# EAGLE design Teedi REV A1 (EAGLE 7.3.0)
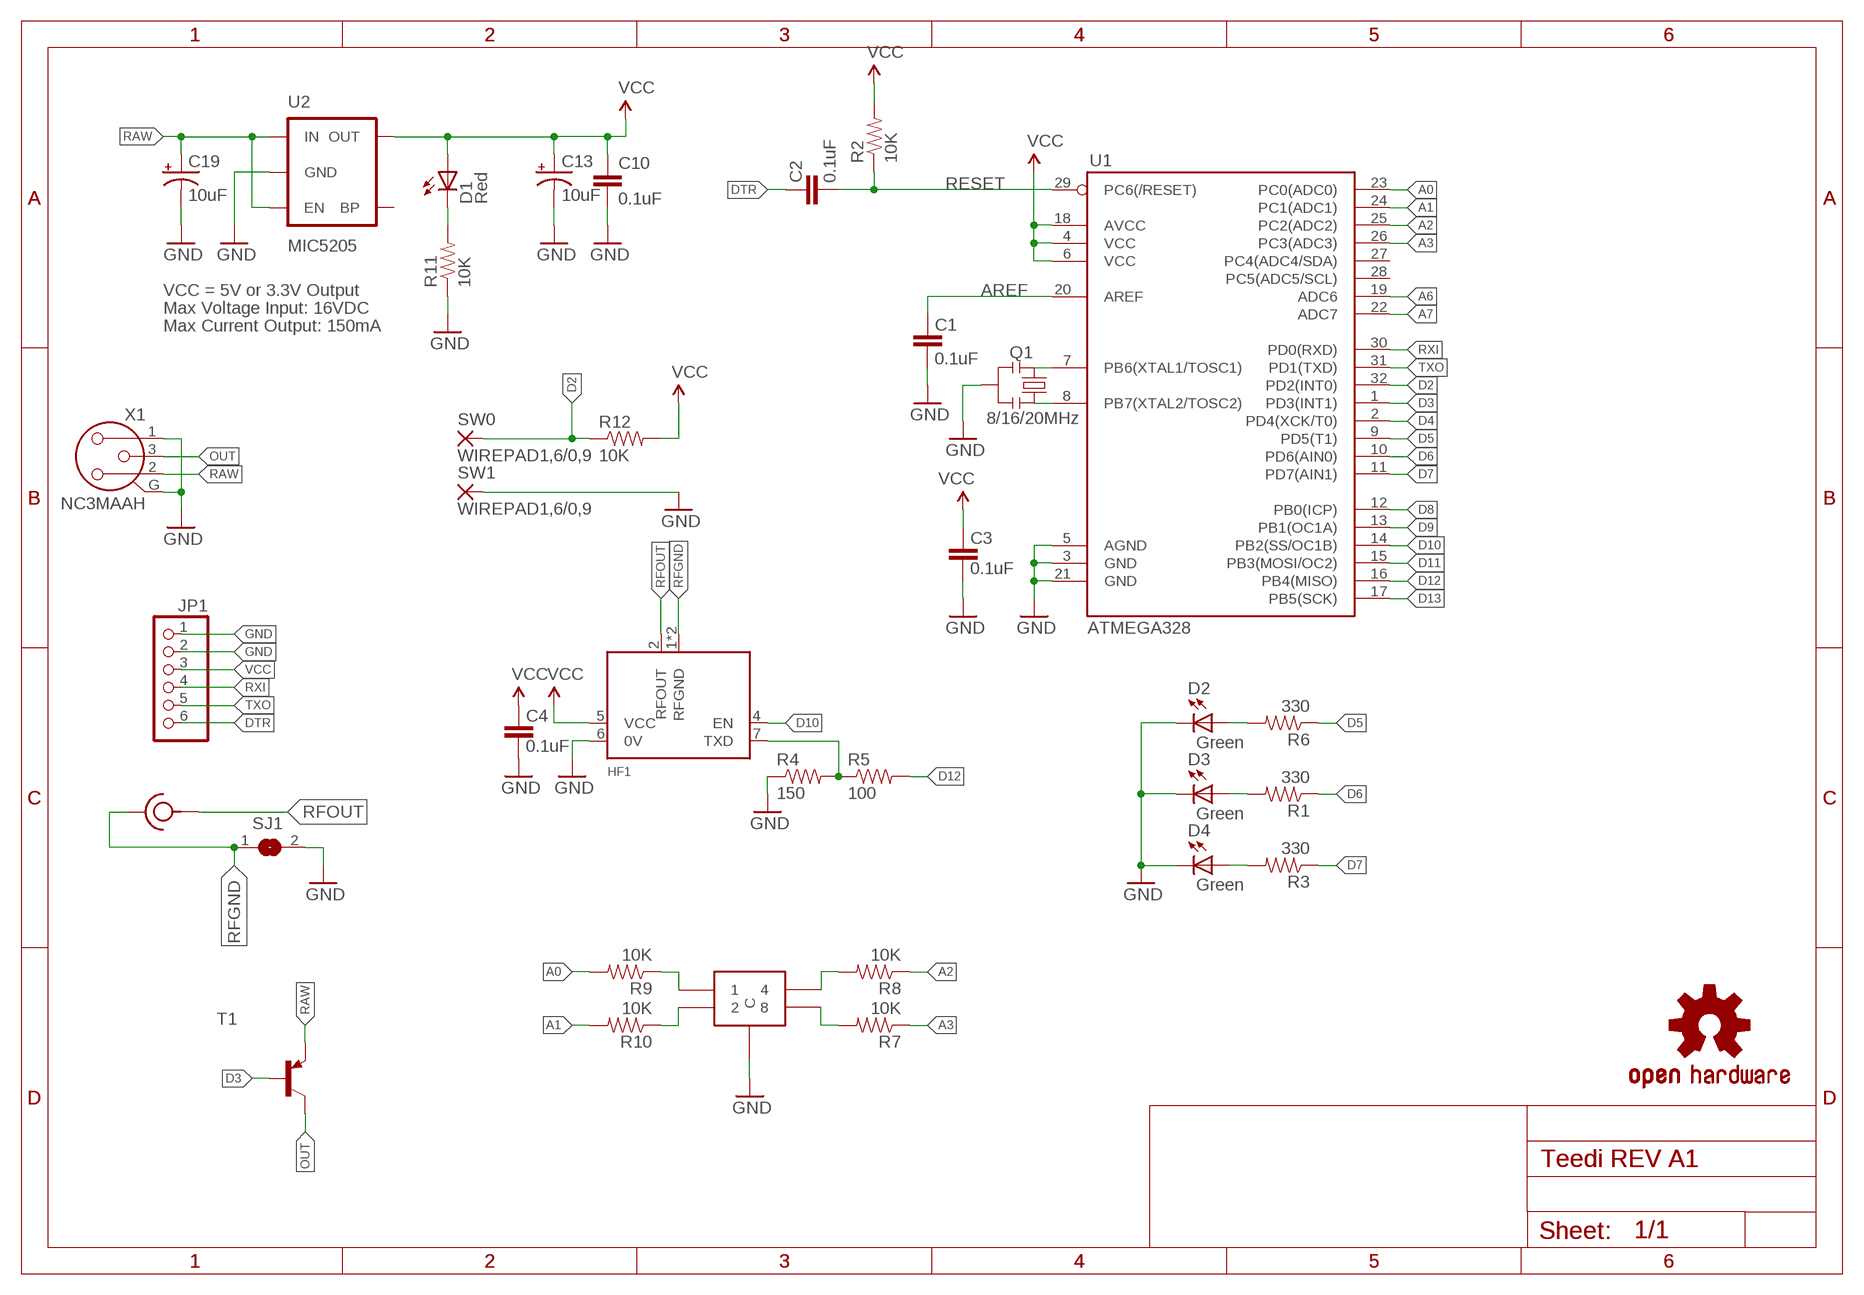
[diagram p0: schematic, sheet 1]

## Parts
C1  0.1uF  CAP0603-CAP  [0603-CAP]
C2  0.1uF  CAP0603-CAP  [0603-CAP]
C3  0.1uF  CAP0603-CAP  [0603-CAP]
C4  0.1uF  CAP0603-CAP  [0603-CAP]
C10  0.1uF  CAP0603-CAP  [0603-CAP]
C13  10uF  CAP_POL1206  [EIA3216]
C19  10uF  CAP_POL1206  [EIA3216]
D1  Red  LED  [0603-LED-ALT1]
D2  Green  LED  [0603-LED-ALT1]
D3  Green  LED  [0603-LED-ALT1]
D4  Green  LED  [0603-LED-ALT1]
HF1  TX2A-433-64  [TX2A]
JP1  PINHD-1X6  [1X06]
Q1  8/16/20MHz  RESONATOR1:1  [RESONATOR-SMD-1:1]
R1  330  RESISTOR0603-RES  [0603-RES]
R2  10K  RESISTOR0603-RES  [0603-RES]
R3  330  RESISTOR0603-RES  [0603-RES]
R4  150  RESISTOR0603-RES  [0603-RES]
R5  100  RESISTOR0603-RES  [0603-RES]
R6  330  RESISTOR0603-RES  [0603-RES]
R7  10K  RESISTOR0603-RES  [0603-RES]
R8  10K  RESISTOR0603-RES  [0603-RES]
R9  10K  RESISTOR0603-RES  [0603-RES]
R10  10K  RESISTOR0603-RES  [0603-RES]
R11  10K  RESISTOR0603-RES  [0603-RES]
R12  10K  RESISTOR0603-RES  [0603-RES]
RF1  132203  [132203]
SJ1  SJ  [SJ]
SW0  WIREPAD1,6/0,9  [1,6/0,9]
SW1  WIREPAD1,6/0,9  [1,6/0,9]
T1  -PNP-SOT23-BCE  [SOT23-BCE]
U1  ATMEGA328  ATMEGA168  [TQFP32-08]
U2  MIC5205  V_REG_LDOSMD  [SOT23-5]
U$3  OSHW-LOGOS  [OSHW-LOGO-S]
U$5  PT65-101-L508  [PT65-101-L508]
X1  NC3MAAH  [NC3MAH]

## Nets
A0: R9.2 U1.23(PC0(ADC0))
A1: R10.2 U1.24(PC1(ADC1))
A2: R8.1 U1.25(PC2(ADC2))
A3: R7.1 U1.26(PC3(ADC3))
A6: U1.19(ADC6)
A7: U1.22(ADC7)
AREF: C1.2 U1.20(AREF)
D2: R12.1 SW0.1(P) U1.32(PD2(INT0))
D3: T1.B U1.1(PD3(INT1))
D4: U1.2(PD4(XCK/T0))
D5: R6.1 U1.9(PD5(T1))
D6: R1.1 U1.10(PD6(AIN0))
D7: R3.1 U1.11(PD7(AIN1))
D8: U1.12(PB0(ICP))
D9: U1.13(PB1(OC1A))
D10: HF1.4(EN) U1.14(PB2(SS/OC1B))
D11: U1.15(PB3(MOSI/OC2))
D12: R5.2 U1.16(PB4(MISO))
D13: U1.17(PB5(SCK))
DTR: C2.2 JP1.6
GND [vcc]: C1.1 C3.1 C4.1 C10.2 C13.C(-) C19.C(-) D2.C D3.C D4.C HF1.6(0V) JP1.1 JP1.2 Q1.2 R4.1 R11.1 SJ1.2 SW1.1(P) U1.3(GND) U1.5(AGND) U1.21(GND) U2.2(GND) U$5.C1(C) U$5.C2(C) X1.1 X1.G
N$1: Q1.3 U1.8(PB7(XTAL2/TOSC2))
N$2: Q1.1 U1.7(PB6(XTAL1/TOSC1))
N$3: D3.A R1.2
N$4: D1.C R11.2
N$5: D4.A R3.2
N$6: HF1.7(TXD) R4.2 R5.1
N$7: D2.A R6.2
N$8: R9.1 U$5.1
N$9: R10.1 U$5.2
N$10: R8.2 U$5.4
N$11: R7.2 U$5.8
OUT: T1.C X1.3
RAW [vcc]: C19.A(+) T1.E U2.1(IN) U2.3(EN) X1.2
RESET: C2.1 R2.1 U1.29(PC6(/RESET))
RFGND: HF1.1(RFGND) HF1.3(RFGND) RF1.G1(GND) RF1.G2(GND) RF1.G3(GND) RF1.G4(GND) SJ1.1
RFOUT: HF1.2(RFOUT) RF1.P(RF)
RXI: JP1.4 U1.30(PD0(RXD))
TXO: JP1.5 U1.31(PD1(TXD))
VCC: C3.2 C4.2 C10.1 C13.A(+) D1.A HF1.5(VCC) JP1.3 R2.2 R12.2 U1.4(VCC) U1.6(VCC) U1.18(AVCC) U2.5(OUT)
Unconnected: U1.27(PC4(ADC4/SDA)) U1.28(PC5(ADC5/SCL)) U2.4(BP)

## Notes on the sheet
- VCC = 5V or 3.3V Output
- Max Voltage Input: 16VDC
- Max Current Output: 150mA

## Library data of the parts
C1-C4 C10 = SparkFun:CAP: Capacitor Standard 0603 ceramic capacitor, and 0.1" leaded capacitor.; MF: MULTICOMP; MPN: MC0603F104Z160CT; OC_FARNELL: 1759017
C13 C19 = SparkFun:CAP_POL: Capacitor Polarized These are standard SMD and PTH capacitors. Normally 10uF, 47uF, and 100uF in electrolytic and tantalum varieties. Always verify the external diameter of the through hole cap, it varies with capacity, voltage, and manufacturer. The EIA devices should be standard.; MF: MULTICOMP; MPN: MCCTA106M006; OC_FARNELL: 1190107
D1 = Testing:LED: LEDs Standard schematic elements and footprints for 5mm, 3mm, 1206, and 0603 sized LEDs. 5mm - Spark Fun Electronics SKU : COM-00529 (and others); MF: MULTICOMP; MPN: MCL-S290SRC; OC_FARNELL: 1581244
D2-D4 = Testing:LED: LEDs Standard schematic elements and footprints for 5mm, 3mm, 1206, and 0603 sized LEDs. 5mm - Spark Fun Electronics SKU : COM-00529 (and others); MF: MULTICOMP; MPN: 703-0109; OC_FARNELL: 2112121
HF1 = radiometrix:TX2A; MF: RADIOMETRIX; MPN: TX2A-433-64; OC_FARNELL: 1348821
JP1 = pinhead:PINHD-1X6: PIN HEADER; MF: MULTICOMP; MPN: MC34751; OC_FARNELL: 1593430
Q1 = Testing:RESONATOR: Resonator Small SMD resonator. This is the itty bitty 10/20MHz resonators with built in caps. CSTCE10M0G55 and CSTCE20M0V53. Footprint for SMD has been used in SFE production for years, and does work okay. 1:1 is an attempt to get larger fillets on the sides so it will be easier to inspect these solders in our AOI machine. The pads have been minimized to match the actual metal under the resonator. To see this relation, it includes an image import of the bottom side of the component. Imported to scale on layer 200.; MF: MURATA; MPN: CSTCE8M00G55Z-R0; OC_FARNELL: 1615352
R1 R3 R6 = SparkFun:RESISTOR: Resistor Basic schematic elements and footprints for 0603, 1206, and PTH resistors.; MF: MULTICOMP; MPN: MCWR06X3300FTL; OC_FARNELL: 2447339
R2 R7-R12 = SparkFun:RESISTOR: Resistor Basic schematic elements and footprints for 0603, 1206, and PTH resistors.; MF: MULTICOMP; MPN: MCHP03W8F1002T5E; OC_FARNELL: 1576297
R4 = SparkFun:RESISTOR: Resistor Basic schematic elements and footprints for 0603, 1206, and PTH resistors.; MF: MULTICOMP; MPN: MCWR06X1500FTL; OC_FARNELL: 2446572
R5 = SparkFun:RESISTOR: Resistor Basic schematic elements and footprints for 0603, 1206, and PTH resistors.; MF: MULTICOMP; MPN: MCWR06X1000FTL; OC_FARNELL: 2447227
RF1 = amphenol:132203; MF: AMPHENOL CONNEX; MPN: 132203; OC_FARNELL: 2144524
SJ1 = jumper:SJ: SMD solder JUMPER; OC_FARNELL: unknown
SW0 SW1 = wirepad:WIREPAD: Wire PAD connect wire on PCB; OC_FARNELL: unknown
T1 = transistor:*-PNP-: PNP Transistror; MF: NXP; MPN: BC807-25; OC_FARNELL: 1081221
U1 = SparkFun:ATMEGA168; MF: ATMEL; MPN: ATMEGA328-AUR; OC_FARNELL: 2443176
U2 = SparkFun:V_REG_LDO: Voltage Regulator LDO Standard 150mA LDO voltage regulator in SOT-23 layout. Micrel part MIC5205. BP (by-pass) pin is used to lower output noise with 470pF cap.; MF: MICREL SEMICONDUCTOR; MPN: MIC5205-3.0YM5 TR; OC_FARNELL: 2100318
U$3 = SparkFun:OSHW-LOGO: Open Source Hardware Logo This logo indicates the piece of hardware it is found on incorporates a OSHW license and/or adheres to the definition of open source hardware found here: http://freedomdefined.org/OSHW; OC_FARNELL: unknown
U$5 = apem:PT65-101-?; MF: APEM; MPN: PT65-101-L508; OC_FARNELL: 1082477
X1 = con-neutrik_ag:NC3: Neutrik Audio Connector XLR SERIES Stereo 1/4" jack Source: www.neutrik.com/; MF: NEUTRIK; MPN: NC3MAAH; OC_FARNELL: 1310044

## Net classes
0 default: width 0.203 mm
1 vcc: width 0.254 mm

## Board
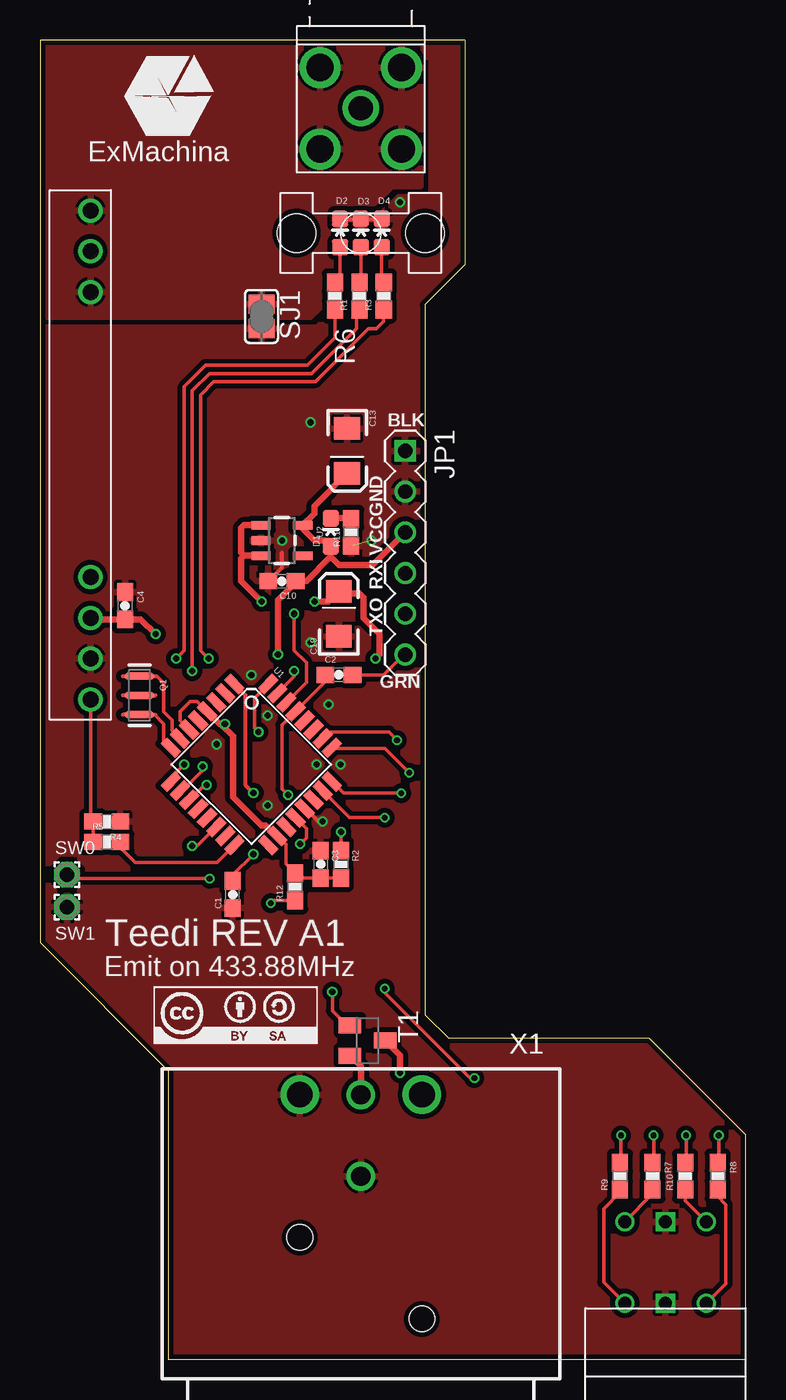
[diagram p1: board, top side]
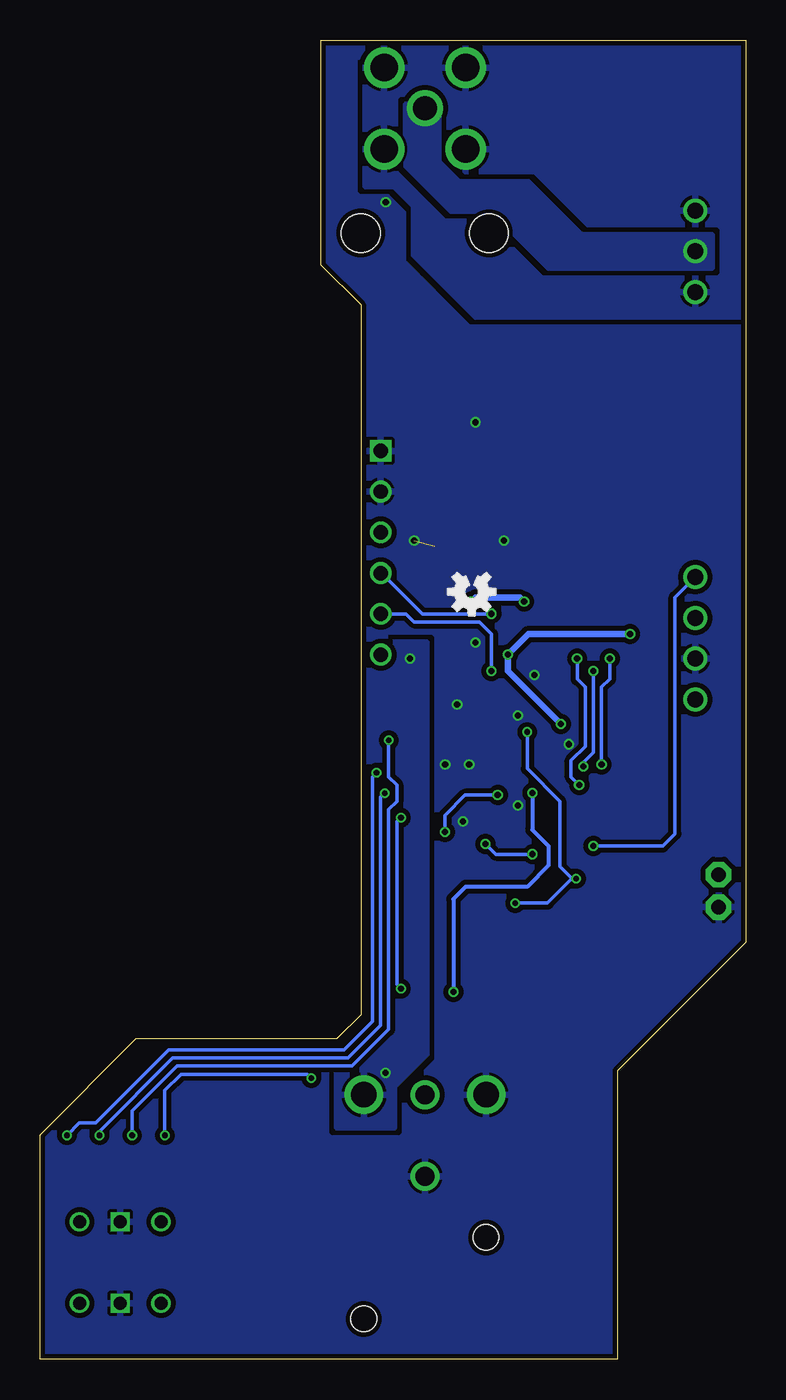
[diagram p2: board, bottom side, seen from below]

Size 44 x 82.25 mm. Coordinates in mm from the lower left corner, seen from the top.
Outline: 26.5,82.25 0,82.25 0,26 8,18 8,0 44,0 44,14 38,20 25.49,20 24,21.49 24,65.75 26.5,68.25 26.5,82.25
Copper layers (1*16): Top 0.018mm / dielectric 1.55mm / Bottom 0.018mm
Design rules "eC_2Layer_PClass6_BaseCopperO18_eCDefault": minimum track width 0.15mm, minimum drill 0.35mm, track to track 0.15mm, track to pad 0.15mm, pad to pad 0.15mm, via to via 0.15mm, smd to smd 0mil, copper to edge 0.25mm, drill to drill 0.35mm, minimum pad ring 0.175mm, minimum via ring 0.125mm, stop-mask expansion 0mil, vias tented up to drill 0.45mm, thermal gap 0.2mm

### Footprints (pad centres in the part's own frame; a part is rotated, then mirrored left to right if it is on the bottom)
0603-CAP = smd 1.1 x 1: 1 -0.85,0; 2 0.85,0
EIA3216 = smd 1.4 x 1.6: A 1.4,0; C -1.4,0
0603-LED-ALT1 = smd 1 x 1: A 0,-0.877; C 0,0.877
TX2A = drill 1: 1 -15.24,0; 2 -12.7,0; 3 -10.16,0; 4 7.62,0; 5 10.16,0; 6 12.7,0; 7 15.24,0
1X06 = drill 0.9 square: 1 -6.35,0 | drill 0.9: 2 -3.81,0; 3 -1.27,0; 4 1.27,0; 5 3.81,0; 6 6.35,0
RESONATOR-SMD-1:1 = smd 0.45 x 1.905: 1 -1.2,0; 2 0,0; 3 1.2,0
0603-RES = smd 1.1 x 1: 1 -0.85,0; 2 0.85,0
132203 = drill 1.7: G1 -2.54,2.54; G2 2.54,2.54; G3 2.54,-2.54; G4 -2.54,-2.54 | drill 1.5: P 0,0
SJ = smd 1.168 x 1.6: 1 -0.762,0; 2 0.762,0
1,6/0,9 = drill 0.914 pad 1.6 octagon: 1 0,0
SOT23-BCE = smd 1 x 1.4: B -0.95,-1.1; C 0.95,-1.1; E 0,1.1
TQFP32-08 = smd 1.27 x 0.559: 1 -4.293,2.8; 2 -4.293,2; 3 -4.293,1.2; 4 -4.293,0.4; 5 -4.293,-0.4; 6 -4.293,-1.2; 7 -4.293,-2; 8 -4.293,-2.8; 17 4.293,-2.8; 18 4.293,-2; 19 4.293,-1.2; 20 4.293,-0.4; 21 4.293,0.4; 22 4.293,1.2; 23 4.293,2; 24 4.293,2.8 | smd 0.559 x 1.27: 9 -2.8,-4.293; 10 -2,-4.293; 11 -1.2,-4.293; 12 -0.4,-4.293; 13 0.4,-4.293; 14 1.2,-4.293; 15 2,-4.293; 16 2.8,-4.293; 25 2.8,4.293; 26 2,4.293; 27 1.2,4.293; 28 0.4,4.293; 29 -0.4,4.293; 30 -1.2,4.293; 31 -2,4.293; 32 -2.8,4.293
SOT23-5 = smd 0.55 x 1.2: 1 -0.95,-1.3; 2 0,-1.3; 3 0.95,-1.3; 4 0.95,1.3; 5 -0.95,1.3
PT65-101-L508 = drill 0.8: 1 2.54,0; 2 -2.54,-5.08; 4 -2.54,0; 8 2.54,-5.08 | drill 0.8 square: C1 0,0; C2 0,-5.08
1275.100 = hole 2.4: 4,0; -4,0
NC3MAH = drill 1.6: 1 3.81,0; 2 -3.81,0 | drill 1.2: 3 0,0; G 0,5.08 | hole 1.6: -3.81,13.97; 3.81,8.89

### Placement (x,y rotation side)
C1  12.01,28.98 90 top
C2  18.64,42.67 0 top
C3  17.49,30.86 270 top
C4  5.3,46.99 270 top
C10  15.08,48.51 180 top
C13  19.14,56.64 270 top
C19  18.64,46.48 90 top
D1  18.13,51.56 0 top
D2  18.7,70.22 0 top
D3  20,70.22 0 top
D4  21.3,70.22 0 top
HF1  3.14,56.39 270 top
JP1  22.77,50.29 270 top
Q1  6.19,41.4 270 top
R1  19.91,66.29 90 top
R2  18.76,30.86 270 top
R3  21.43,66.29 90 top
R4  4.16,33.53 180 top
R5  4.16,32.26 0 top
R6  18.38,66.29 90 top
R7  38.19,11.43 270 top
R8  42.26,11.43 270 top
R9  36.16,11.43 90 top
R10  40.23,11.43 90 top
R11  19.4,51.56 90 top
R12  15.91,29.46 90 top
RF1  20,78 0 top
SJ1  13.81,65.02 270 top
SW0  1.68,30.23 270 top
SW1  1.68,28.19 270 top
T1  20.42,19.88 270 top
U1  13.18,37.08 315 top
U2  15.08,51.05 270 top
U$3  17.09,47.85 180 bottom
U$4  [CC-BY-SA]  12.35,21.91 0 top
U$5  39,3.5 180 top
U$7  [EXM-LOGO]  7.97,78.74 0 top
U$8  [1275.100]  20,70.22 0 top
X1  20,16.5 180 top

### Tracks (layer width: path | path; a pad name or v marks a point on that pad's centre or on a via)
A0  (via drill 0.35)
  Top 0.203: U1.23 19.3,33.78 v21.5,33.78 | v21.5,23.11 21.5,22.86 26.83,17.53 v27.08,17.53 | v36.23,13.97 36.23,12.35 R9.2
  Bottom 0.203: v21.5,33.78 21.75,33.53 21.75,23.37 v21.5,23.11 | v27.08,17.53 27.34,17.78 35.21,17.78 36.23,16.76 v36.23,13.97
A1  (via drill 0.35)
  Top 0.203: U1.24 18.91,35.31 v22.51,35.31 | R10.2 40.29,12.35 v40.29,13.97
  Bottom 0.203: v22.51,35.31 22.77,35.05 22.77,20.83 24.8,18.8 35.72,18.8 40.29,14.22 v40.29,13.97
A2  (via drill 0.35)
  Top 0.203: R8.1 42.32,12.35 v42.32,13.97 | v23.02,36.58 21.5,38.1 18.23,38.1 U1.25
  Bottom 0.203: v23.02,36.58 23.27,36.32 23.27,21.08 25.05,19.3 35.97,19.3 40.55,14.73 41.56,14.73 v42.32,13.97
A3  (via drill 0.35)
  Top 0.203: U1.26 17.72,38.7 18.13,39.12 21.75,39.12 v22.26,38.61 | R7.1 38.26,12.35 v38.26,13.97
  Bottom 0.203: v22.26,38.61 22.26,36.32 21.75,35.81 21.75,34.8 22.26,34.29 22.26,20.57 24.54,18.29 35.47,18.29 38.26,15.49 v38.26,13.97
AREF  (via drill 0.38)
  Top 0.203: U1.20 16.6,33.09 16.6,32.51 v16.22,32.13 | v13.3,31.5 12.01,30.2 C1.2
  Bottom 0.203: v16.22,32.13 15.59,31.5 v13.3,31.5
D2  (via drill 0.35)
  Top 0.203: U1.32 13.37,41.24 13.37,39.37 v13.62,39.12 | v10.57,29.97 1.94,29.97 SW0.1 | R12.1 14.55,28.61 v14.38,28.45
  Bottom 0.203: v13.62,39.12 13.62,36.83 11.59,34.8 11.59,30.73 10.83,29.97 | v14.38,28.45 12.35,28.45 10.83,29.97 | 10.83,29.97 v10.57,29.97
D3  (via drill 0.38)
  Top 0.203: v18.22,22.92 18.22,21.73 19.12,20.83 T1.B
  Top 0.254: U1.1 12.79,41.42 12.79,35.81 v13.3,35.31
  Bottom 0.254: v13.3,35.31 13.3,33.02 12.29,32 12.29,30.8 13.62,29.46 17.46,29.46 18.22,28.7 v18.22,22.92
D5  (via drill 0.38)
  Top 0.203: U1.9 8.16,36.26 v8.98,37.08 | v8.48,43.69 8.98,44.2 8.98,60.64 10.32,61.98 16.67,61.98 18.38,63.69 R6.1
  Bottom 0.203: v8.98,37.08 8.98,41.91 8.48,42.42 v8.48,43.69
D6  (via drill 0.38)
  Top 0.203: U1.10 8.89,35.46 10.13,36.7 v10.13,36.96 | v9.49,42.93 9.49,60.39 10.57,61.47 16.92,61.47 19.72,64.26 19.72,65.26 R1.1
  Bottom 0.203: v10.13,36.96 10.13,37.21 9.49,37.85 v9.49,42.93
D7  (via drill 0.38)
  Top 0.203: U1.11 9.34,34.9 10.25,35.81 v10.38,35.81 | v10.51,43.69 10,44.2 10,60.13 10.83,60.96 17.18,60.96 20.48,64.26 20.99,64.26 21.43,64.7 R3.1
  Bottom 0.203: v10.38,35.81 10.89,36.32 10.89,37.34 10,38.23 10,41.91 10.51,42.42 v10.51,43.69
D10  (via drill 0.38)
  Top 0.203: U1.14 9.79,32 v9.49,32
  Bottom 0.203: v9.49,32 5.17,32 4.41,32.77 4.41,47.5 HF1.4
D12
  Top 0.203: U1.16 11.04,30.99 5.94,30.99 5.01,31.92 R5.2
DTR
  Top 0.203: C2.2 21.43,42.67 22.7,43.94 JP1.6
GND  (via drill 0.38)  (1 unrouted)
  Top 0.254: U1.21 16.56,34.33 17.37,33.53 | D2.C D3.C D4.C | C10.2 15.08,49.36 15.08,50.29
  other vias: 15.08,51.05 13.18,42.67 17.62,33.53 20.67,51.05 16.86,44.7 14.19,40.13 17.24,37.08 14.19,34.54 16.86,58.42 11.02,38.35 22.45,72.14 18.74,37.08 17.99,40.83
  pour Top (isolate 0.305, rank 6): -10,85 50,85 50,-1 -10,-1
  pour Bottom (isolate 0.305, rank 6): -10,85 50,85 50,-1 -10,-1
N$1
  Top 0.203: 7.21,40.2 7.14,40.2 7.71,39.62 7.71,38.59 U1.8
N$2
  Top 0.203: 7.21,42.6 7.28,42.6 7.71,42.16 7.71,40.39 8.22,39.88 8.22,39.21 U1.7
N$3
  Top 0.203: D3.A 20,67.24 R1.2
N$4
  Top 0.203: R11.2 19.37,52.44 19.14,52.44
  Top 0.406: D1.C 19.14,52.44 19.24,52.44
N$5
  Top 0.203: D4.A 21.3,67.27 R3.2
N$6
  Top 0.203: R5.1 R4.2 3.14,33.69 HF1.7
N$7
  Top 0.203: D2.A 18.7,67.46 R6.2
N$8
  Top 0.203: R9.1 36.16,10.41 35.15,9.4 35.15,4.81 U$5.1
N$9
  Top 0.203: R10.1 40.23,9.89 U$5.2
N$10
  Top 0.203: R8.2 42.26,10.16 42.77,9.65 42.77,4.73 U$5.4
N$11
  Top 0.203: R7.2 38.19,10.31 U$5.8
OUT
  Top 0.406: T1.C 20,18.26 X1.3
RAW  (via drill 0.38)
  Top 0.406: U2.1 12.73,52 12.54,51.82 12.54,50.29 12.73,50.1 | 12.73,50.1 U2.3 | v17.11,47.24 18,47.24 C19.A 18.77,47.75 19.91,47.75 20.16,47.5 20.16,46.23 21.18,45.21 21.18,43.94 v20.92,43.69 | v13.81,47.24 12.54,48.51 12.54,49.92 12.73,50.1 | T1.E 22.45,18.95 v22.45,17.85
  Bottom 0.406: v17.11,47.24 16.86,47.5 14.06,47.5 v13.81,47.24
  pour Bottom (isolate 0.305): 21.94,14.48 25.49,14.48 25.49,25.47 25.56,44.7 19.91,44.7 19.91,19.05 21.94,17.02
RESET  (via drill 0.38)
  Top 0.203: v15.46,35.18 15.08,35.56 15.08,39.55 U1.29 17.79,42.26 C2.1 | v18.76,32.89 R2.1
  Bottom 0.203: v15.46,35.18 17.49,35.18 18.76,33.91 v18.76,32.89
RFGND
  pour Bottom (isolate 0.305, rank 5): -0.11,65.02 -0.11,82.3 23.72,82.3 23.72,73.15 21.94,73.15 20.67,71.88 20.67,68.83 16.86,65.02
  pour Top (isolate 0.305, rank 5): 0,82.3 0,65.02 16.86,65.02 20.67,68.58 20.67,71.88 21.94,73.15 23.72,73.15 23.72,82.3
RFOUT
  pour Bottom (no thermals): 2.13,70.1 2.13,68.07 12.29,68.07 15.84,71.63 18.38,71.63 21.18,74.42 21.18,78.23 19.14,78.23 19.14,74.68 17.87,73.41 13.56,73.41 10.25,70.1
RXI  (via drill 0.38)
  Top 0.203: v15.84,46.48 15.84,44.2 16.6,43.43 16.6,42.21 U1.30
  Bottom 0.203: v15.84,46.48 20.16,46.48 22.7,49.02 JP1.4
TXO  (via drill 0.38)
  Top 0.203: v15.84,42.93 15.84,42.58 U1.31
  Bottom 0.203: v15.84,42.93 15.84,45.21 16.6,45.97 20.67,45.97 21.18,46.48 JP1.5
VCC  (via drill 0.38)
  Top 0.203: R2.2 C3.2 16.21,30.01 R12.2 15.33,30.89 15.33,32.1 U1.18 14.7,32.63 | 11.4,39.5 v11.52,39.62 | 15.93,48.44 C10.1 | U1.6 8.73,39.83 8.73,40.39 9.36,41.02 9.8,41.02 U1.4
  Top 0.406: C13.A 17.11,53.21 17.11,52.74 U2.5 16.38,51.79 17.11,51.05 17.76,51.05 D1.A 18.13,50.04 | 18.13,50.04 18.64,49.53 20.73,49.53 JP1.3 | 18.13,50.04 16.6,48.51 C10.1 | v14.83,43.94 14.83,47.33 15.93,48.44 | U1.4 11.2,39.62 v11.52,39.62 | 14.7,32.63 14.06,33.27 13.81,33.27 12.03,35.05 12.03,38.86 11.4,39.5 | v7.21,45.21 6.28,46.14 C4.2 3.23,46.14 HF1.5
  Bottom 0.406: v11.52,39.62 14.83,42.93 v14.83,43.94 13.56,45.21 v7.21,45.21

### Text on the board
tPlace: BLK | GND | VCC | RXI | TXO | GRN
tNames: ExMachina | Teedi REV A1 | Emit on 433.88MHz
tValues: Valid combinations: | 168V / 3.3V Reg / 8MHz | 168 / 5V Reg / 16MHz | 168 / 5V Reg / 20MHz | Mark back accordingly | Arduino Pro Mini
Document: Released under the Creative Commons Attribution Share-Alike 3.0 License / http://creativecommons.org/licenses/by-sa/3.0 / Inspired from Arduino Pro Mini design / Designed by Benoit Rapidel - ExMachina